# EAGLE schematic solenoid (EAGLE 6.4)

## Sheet 1 of 3
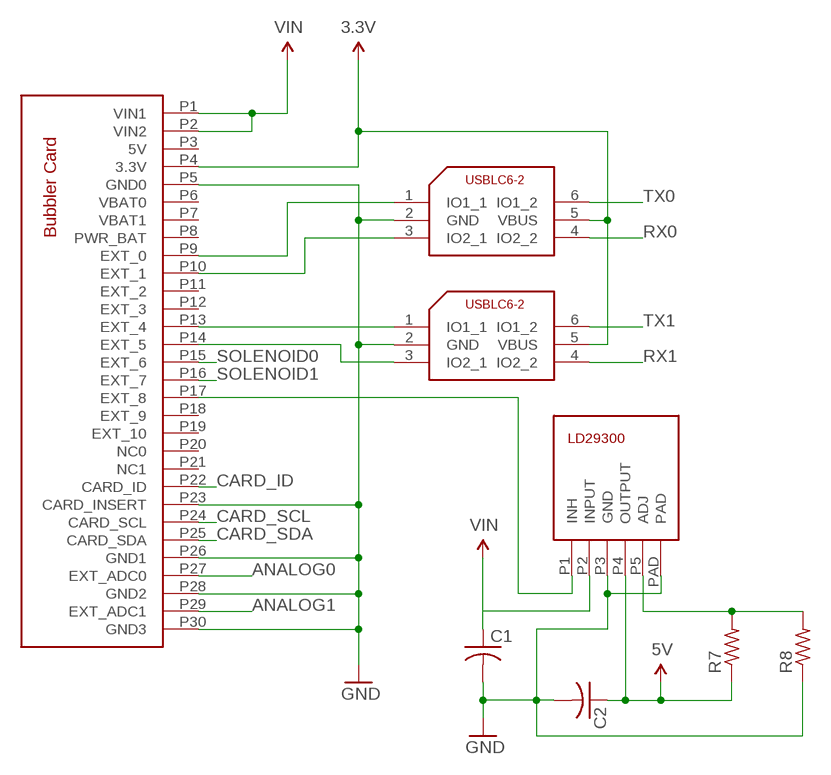
[diagram p0: schematic, sheet 1]

### Parts
C1  C-USC0805  [C0805]
C2  C-USC0805  [C0805]
R7  R-US_R0402  [R0402]
R8  R-US_R0402  [R0402]
U1  BUBBLER_CARD  [CONNECTOR-JAE-TX24-30M]
U10  USBLC6-2  [SOT23-6L]
U11  USBLC6-2  [SOT23-6L]
U$3  LD29300P2MTR  [P2PAK/A]

### Nets
3.3V: U1.P4(3.3V) U10.5(VBUS) U11.5(VBUS) ; supply symbol labelled @3.3V ; also sheet 2,3
5V: C2.1 R7.1 U$3.P4(OUTPUT) ; supply symbol labelled @5V ; also sheet 3
ANALOG0: U1.P27(EXT_ADC0) ; also sheet 3
ANALOG1: U1.P29(EXT_ADC1) ; also sheet 3
CARD_ID: U1.P22(CARD_ID) ; also sheet 2
CARD_SCL: U1.P24(CARD_SCL) ; also sheet 2
CARD_SDA: U1.P25(CARD_SDA) ; also sheet 2
GND: C1.2 C2.2 R8.1 U1.P5(GND0) U1.P23(CARD_INSERT) U1.P26(GND1) U1.P28(GND2) U1.P30(GND3) U10.2(GND) U11.2(GND) U$3.P3(GND) U$3.PAD ; supply symbol labelled @GND ; also sheet 2,3
N$2: U1.P9(EXT_0) U10.1(IO1_1)
N$9: U1.P10(EXT_1) U10.3(IO2_1)
N$10: U1.P13(EXT_4) U11.1(IO1_1)
N$11: U1.P14(EXT_5) U11.3(IO2_1)
N$14: U1.P17(EXT_8) U$3.P1(INH)
N$16: R7.2 R8.2 U$3.P5(ADJ)
RX0: U10.4(IO2_2) ; also sheet 3
RX1: U11.4(IO2_2) ; also sheet 3
SOLENOID0: U1.P15(EXT_6) ; also sheet 3
SOLENOID1: U1.P16(EXT_7) ; also sheet 3
TX0: U10.6(IO1_2) ; also sheet 3
TX1: U11.6(IO1_2) ; also sheet 3
VIN: C1.1 U1.P1(VIN1) U1.P2(VIN2) U$3.P2(INPUT) ; supply symbol labelled @VIN
Unconnected: U1.P3(5V) U1.P6(VBAT0) U1.P7(VBAT1) U1.P8(PWR_BAT) U1.P11(EXT_2) U1.P12(EXT_3) U1.P18(EXT_9) U1.P19(EXT_10) U1.P20(NC0) U1.P21(NC1)

## Sheet 2 of 3
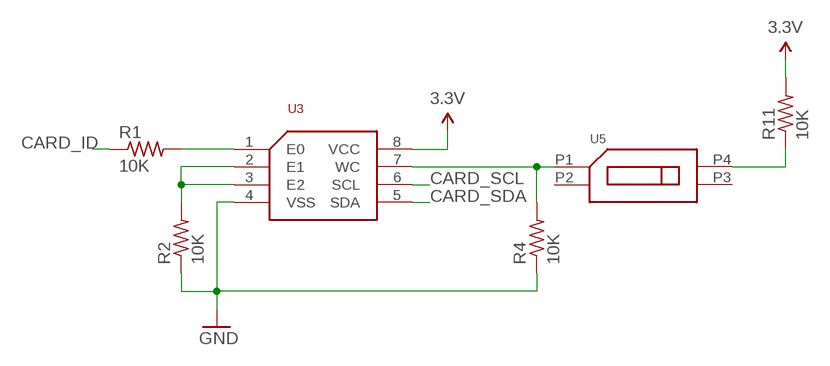
[diagram p1: schematic, sheet 2]

### Parts
R1  10K  R-US_R0402  [R0402]
R2  10K  R-US_R0402  [R0402]
R4  10K  R-US_R0402  [R0402]
R11  10K  R-US_R0402  [R0402]
U3  EEPROM-ST-M24C64  [TSSOP8]
U5  SWITCH-DIP-GDH-02  [SWITCH-DIP-GDH-02]

### Nets
3.3V: R11.2 U3.8(VCC) ; supply symbol labelled @3.3V ; also sheet 1,3
CARD_ID: R1.1 ; also sheet 1
CARD_SCL: U3.6(SCL) ; also sheet 1
CARD_SDA: U3.5(SDA) ; also sheet 1
GND: R2.1 R4.1 U3.4(VSS) ; supply symbol labelled @GND ; also sheet 1,3
N$17: R2.2 U3.2(E1) U3.3(E2)
N$19: R1.2 U3.1(E0)
N$20: R11.1 U5.P4(SW0_1)
N$21: R4.2 U3.7(WC) U5.P1(SW0_0)
Unconnected: U5.P2(SW1_0) U5.P3(SW1_1)

## Sheet 3 of 3
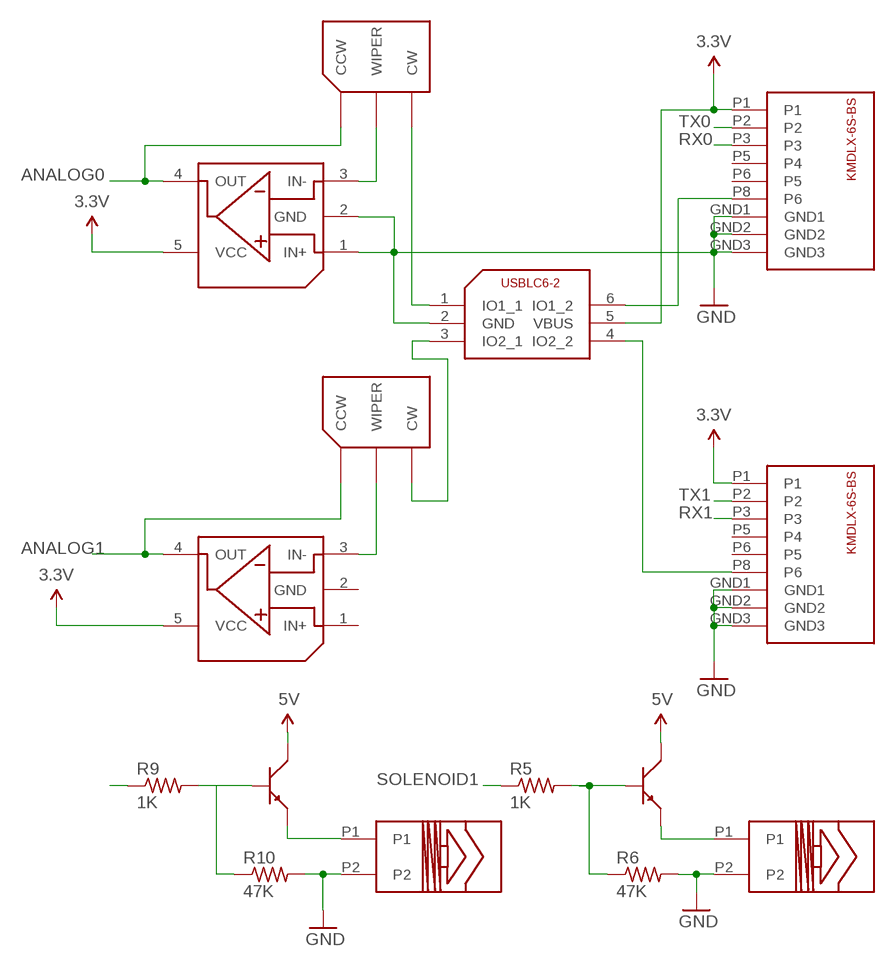
[diagram p2: schematic, sheet 3]

### Parts
R5  1K  R-US_R0402  [R0402]
R6  47K  R-US_R0402  [R0402]
R9  1K  R-US_R0402  [R0402]
R10  47K  R-US_R0402  [R0402]
U2  OPAMP-ST-LMV321ILT  [SOT23-5L]
U4  OPAMP-ST-LMV321ILT  [SOT23-5L]
U6  BIPOLAR-PMBT6428  [DUBLIB_SOT23]
U8  BIPOLAR-PMBT6428  [DUBLIB_SOT23]
U9  USBLC6-2  [SOT23-6L]
U12  BOURNES-TC73  [TC73X]
U13  BOURNES-TC73  [TC73X]
U$1  KMDLX-6S-BS  [KMDLX-6S-BS]
U$4  KMDLX-6S-BS  [KMDLX-6S-BS]
U$5  PARKER-XVALVE-8MM  [PARKER-XVALVE-8MM]
U$7  PARKER-XVALVE-8MM  [PARKER-XVALVE-8MM]

### Nets
3.3V: U2.5(VCC) U4.5(VCC) U9.5(VBUS) U$1.P1 U$4.P1 ; supply symbol labelled @3.3V ; also sheet 1,2
5V: U6.3 U8.3 ; supply symbol labelled @5V ; also sheet 1
ANALOG0: U4.4(OUT) U13.P$1(CCW) ; also sheet 1
ANALOG1: U2.4(OUT) U12.P$1(CCW) ; also sheet 1
GND: R6.2 R10.2 U4.1(IN+) U4.2(GND) U9.2(GND) U$1.GND1 U$1.GND2 U$1.GND3 U$4.GND1 U$4.GND2 U$4.GND3 U$5.P2 U$7.P2 ; supply symbol labelled @GND ; also sheet 1,2
N$1: U6.2 U$5.P1
N$3: R5.2 R6.1 U6.1
N$4: U8.2 U$7.P1
N$5: U9.1(IO1_1) U13.P$3(CW)
N$6: R9.2 R10.1 U8.1
N$7: U2.3(IN-) U12.P$2(WIPER)
N$8: U9.3(IO2_1) U12.P$3(CW)
N$12: U9.6(IO1_2) U$1.P8(P6)
N$13: U9.4(IO2_2) U$4.P8(P6)
N$15: U4.3(IN-) U13.P$2(WIPER)
RX0: U$1.P3 ; also sheet 1
RX1: U$4.P3 ; also sheet 1
SOLENOID0: R9.1 ; also sheet 1
SOLENOID1: R5.1 ; also sheet 1
TX0: U$1.P2 ; also sheet 1
TX1: U$4.P2 ; also sheet 1
Unconnected: U2.1(IN+) U2.2(GND) U$1.P5(P4) U$1.P6(P5) U$4.P5(P4) U$4.P6(P5)

## Library data of the parts
C1 C2 = rcl:C-US: CAPACITOR, American symbol
R1 R2 R4-R11 = rcl:R-US_: RESISTOR, American symbol
U1 = Pygmy:BUBBLER_CARD
U2 U4 = Pygmy:OPAMP-ST-LMV321ILT
U3 = Pygmy:EEPROM-ST-M24C64
U5 = Pygmy:SWITCH-DIP-GDH-02
U6 U8 = Pygmy:BIPOLAR-PMBT6428
U9-U11 = Pygmy:USBLC6-2
U12 U13 = Pygmy:BOURNES-TC73
U$1 U$4 = Pygmy:KMDLX-6S-BS
U$3 = Pygmy:LD29300P2MTR
U$5 U$7 = Pygmy:PARKER-XVALVE-8MM